# EAGLE design Hydro_Board (EAGLE 9.6.2)
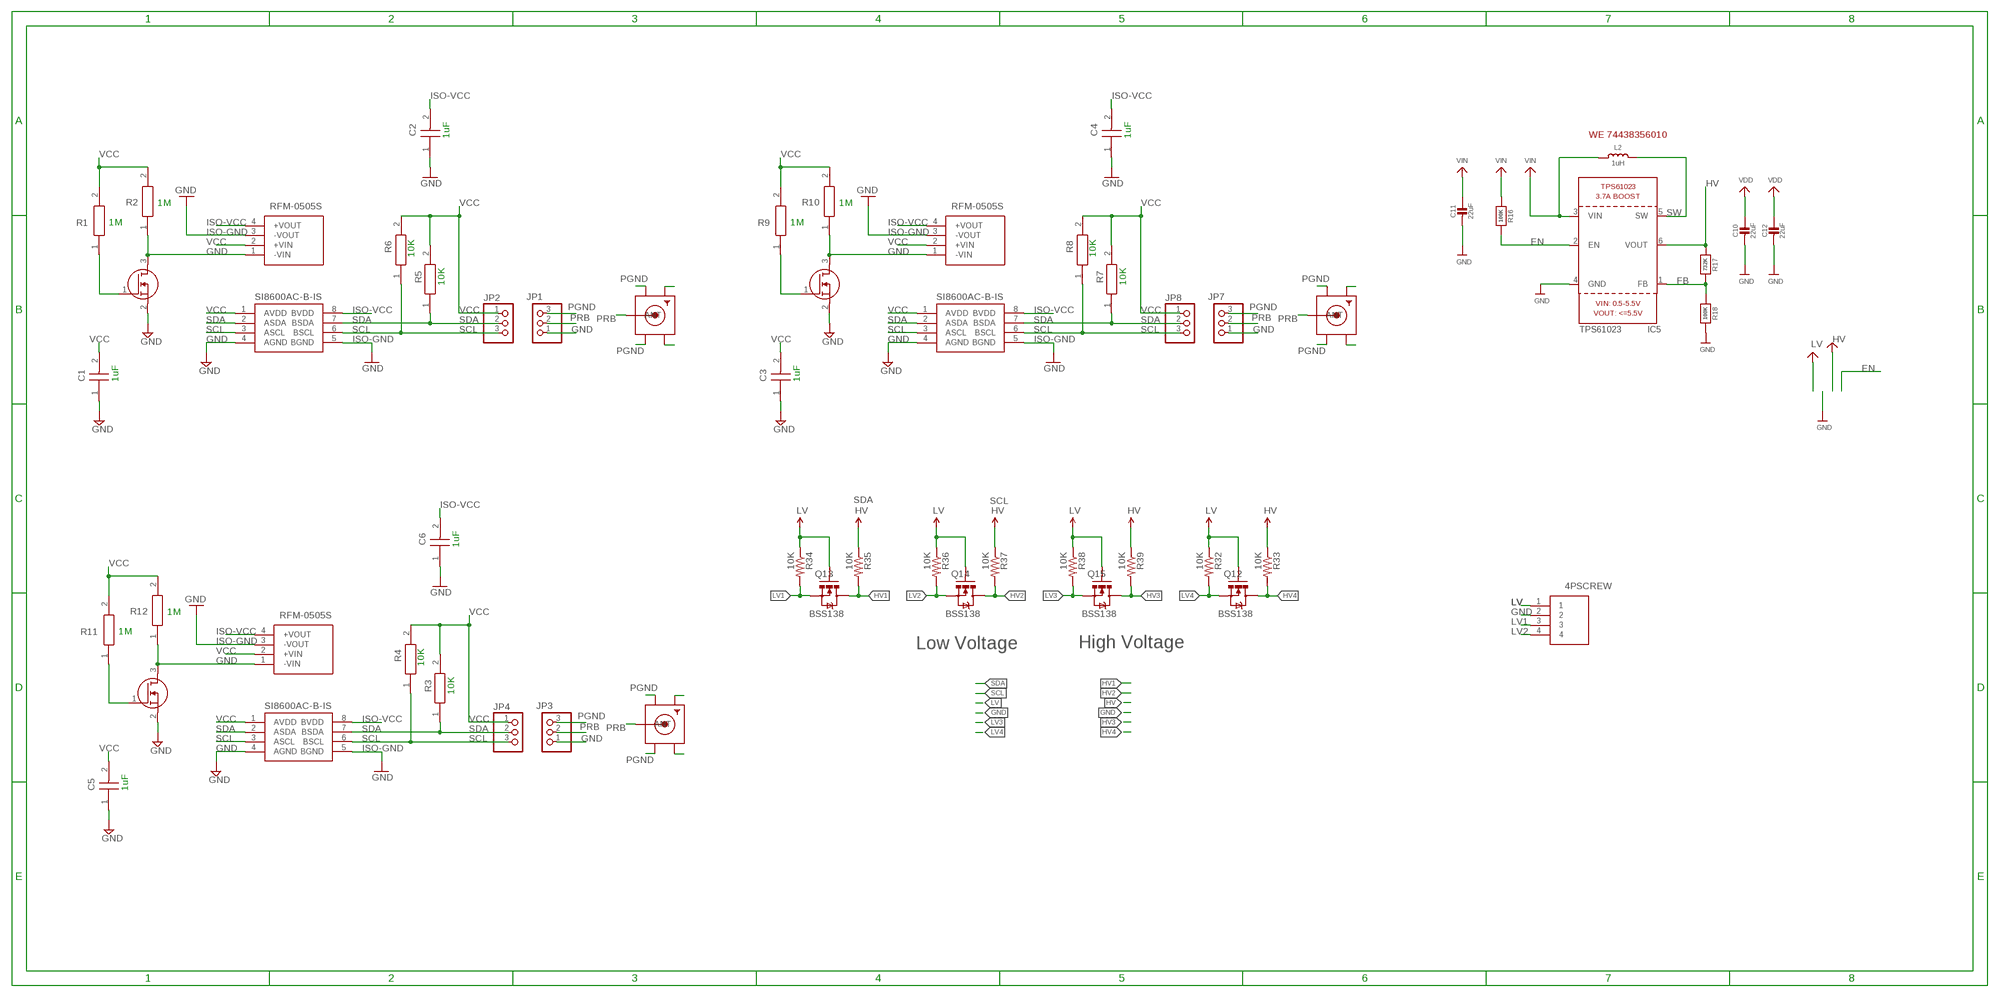
[diagram p0: schematic, sheet 1]

## Parts
4PSCREW  1725672  [1725672]
C1  C1608X5R1E105K080AC  [CAPC1608X80N]
C2  C1608X5R1E105K080AC  [CAPC1608X80N]
C3  C1608X5R1E105K080AC  [CAPC1608X80N]
C4  C1608X5R1E105K080AC  [CAPC1608X80N]
C5  C1608X5R1E105K080AC  [CAPC1608X80N]
C6  C1608X5R1E105K080AC  [CAPC1608X80N]
C10  22uF  CAP_CERAMIC0805-NOOUTLINE  [0805-NO]
C11  22uF  CAP_CERAMIC0805-NOOUTLINE  [0805-NO]
C12  22uF  CAP_CERAMIC0805-NOOUTLINE  [0805-NO]
IC1  SI8600AC-B-IS  [SOIC127P600X175-8N]
IC2  SI8600AC-B-IS  [SOIC127P600X175-8N]
IC4  SI8600AC-B-IS  [SOIC127P600X175-8N]
IC5  TPS61023  [SOT563]
JP1  PINHD-1X3  [1X03]
JP2  PINHD-1X3  [1X03]
JP3  PINHD-1X3  [1X03]
JP4  PINHD-1X3  [1X03]
JP7  PINHD-1X3  [1X03]
JP8  PINHD-1X3  [1X03]
L2  1uH  INDUCTORTDK_VLC5045  [INDUCTOR_5X5MM_TDK_VLC5045]
PS1  RFM-0505S  [RFM0505S]
PS3  RFM-0505S  [RFM0505S]
PS4  RFM-0505S  [RFM0505S]
Q1  BSS119NH6327XTSA1  [SOT95P260X110-3N]
Q2  BSS119NH6327XTSA1  [SOT95P260X110-3N]
Q3  BSS119NH6327XTSA1  [SOT95P260X110-3N]
Q12  BSS138  MOSFET-NCHANNELSMD  [SOT23-3]
Q13  BSS138  MOSFET-NCHANNELSMD  [SOT23-3]
Q14  BSS138  MOSFET-NCHANNELSMD  [SOT23-3]
Q15  BSS138  MOSFET-NCHANNELSMD  [SOT23-3]
R1  ERJ-3EKF1004V  [RESC1608X55N]
R2  ERJ-3EKF1004V  [RESC1608X55N]
R3  CRCW060310K0FKEAHP  [RESC1608X50N]
R4  CRCW060310K0FKEAHP  [RESC1608X50N]
R5  CRCW060310K0FKEAHP  [RESC1608X50N]
R6  CRCW060310K0FKEAHP  [RESC1608X50N]
R7  CRCW060310K0FKEAHP  [RESC1608X50N]
R8  CRCW060310K0FKEAHP  [RESC1608X50N]
R9  ERJ-3EKF1004V  [RESC1608X55N]
R10  ERJ-3EKF1004V  [RESC1608X55N]
R11  ERJ-3EKF1004V  [RESC1608X55N]
R12  ERJ-3EKF1004V  [RESC1608X55N]
R16  100K  RESISTOR_0603_NOOUT  [0603-NO]
R17  732K  RESISTOR_0603_NOOUT  [0603-NO]
R18  100K  RESISTOR_0603_NOOUT  [0603-NO]
R32  10K  RESISTOR0603-RES  [0603-RES]
R33  10K  RESISTOR0603-RES  [0603-RES]
R34  10K  RESISTOR0603-RES  [0603-RES]
R35  10K  RESISTOR0603-RES  [0603-RES]
R36  10K  RESISTOR0603-RES  [0603-RES]
R37  10K  RESISTOR0603-RES  [0603-RES]
R38  10K  RESISTOR0603-RES  [0603-RES]
R39  10K  RESISTOR0603-RES  [0603-RES]
X1  SMACONNECTOR_EDGE  [SMA_EDGELAUNCH]
X2  SMACONNECTOR_EDGE  [SMA_EDGELAUNCH]
X4  SMACONNECTOR_EDGE  [SMA_EDGELAUNCH]

## Nets
EN: IC5.2(EN) R16.2
FB: IC5.1(FB) R17.2 R18.1
GND: 4PSCREW.2 C1.1 C2.1 C3.1 C5.1 C10.2 C11.2 C12.2 IC1.4(AGND) IC2.4(AGND) IC4.4(AGND) IC5.4(GND) JP1.1 JP3.1 JP7.1 PS1.1(-VIN) PS3.1(-VIN) PS4.1(-VIN) Q1.2(S) Q1.3(D) Q2.2(S) Q2.3(D) Q3.2(S) Q3.3(D) R2.1 R10.1 R12.1 R18.2
HV: IC5.6(VOUT) R17.1 R33.1 R39.1 ; supply symbol labelled VDD
HV1: Q13.3(D) R35.2
HV2: Q14.3(D) R37.2
HV3: Q15.3(D) R39.2
HV4: Q12.3(D) R33.2
ISO-GND: IC1.5(BGND) IC2.5(BGND) IC4.5(BGND) PS1.3(-VOUT) PS3.3(-VOUT) PS4.3(-VOUT) ; supply symbol labelled GND
ISO-VCC: C2.2 C4.2 C6.2 IC1.8(BVDD) IC2.8(BVDD) IC4.8(BVDD) PS1.4(+VOUT) PS3.4(+VOUT) PS4.4(+VOUT)
LV: 4PSCREW.1 IC5.3(VIN) L2.P$1 Q12.1(G) Q13.1(G) Q14.1(G) Q15.1(G) R32.1 R34.1 R36.1 R38.1 ; supply symbol labelled VIN
LV1: 4PSCREW.3 Q13.2(S) R34.2
LV2: 4PSCREW.4 Q14.2(S) R36.2
LV3: Q15.2(S) R38.2
LV4: Q12.2(S) R32.2
N$1: C4.1 ; supply symbol labelled GND
N$2: Q1.1(G) R1.1
N$3: X4.GND@3(GND2)
N$4: X2.GND@3(GND2)
N$5: X2.GND@1(GND4)
N$6: C6.1 ; supply symbol labelled GND
N$7: X4.GND@1(GND4)
N$8: Q3.1(G) R11.1
N$11: X1.GND@3(GND2)
N$12: X1.GND@1(GND4)
N$14: Q2.1(G) R9.1
PGND: JP1.3 JP3.3 JP7.3 X1.GND@2(GND3) X1.GND@4(GND1) X2.GND@2(GND3) X2.GND@4(GND1) X4.GND@2(GND3) X4.GND@4(GND1)
PRB: JP1.2 JP3.2 JP7.2 X1.P(ANT) X2.P(ANT) X4.P(ANT)
SCL: IC1.3(ASCL) IC1.6(BSCL) IC2.3(ASCL) IC2.6(BSCL) IC4.3(ASCL) IC4.6(BSCL) JP2.3 JP4.3 JP8.3 R4.1 R6.1 R8.1 R37.1 ; supply symbol labelled HV
SDA: IC1.2(ASDA) IC1.7(BSDA) IC2.2(ASDA) IC2.7(BSDA) IC4.2(ASDA) IC4.7(BSDA) JP2.2 JP4.2 JP8.2 R3.1 R5.1 R7.1 R35.1 ; supply symbol labelled HV
SW: IC5.5(SW) L2.P$2
VCC [New Class]: C1.2 C3.2 C5.2 IC1.1(AVDD) IC2.1(AVDD) IC4.1(AVDD) JP2.1 JP4.1 JP8.1 PS1.2(+VIN) PS3.2(+VIN) PS4.2(+VIN) R1.2 R2.2 R3.2 R4.2 R5.2 R6.2 R7.2 R8.2 R9.2 R10.2 R11.2 R12.2
VDD: C10.1 C12.1
VIN: C11.1 R16.1

## Notes on the sheet
- 1uF | 1uF | WE 74438356010
- 1M | 1M
- 1M | 1M
- 10K | 10K
- 10K | 10K
- 1uF | 1uF
- 1uF
- 1M
- 1M
- Low Voltage | High Voltage
- 10K
- 10K
- 1uF

## Library data of the parts
4PSCREW = 4pin_screw:1725672: 4 way vertical PCB terminal,6A 63V Phoenix Contact Non-Fused Terminal Block, 4 Way, Solder Terminals, 26 ??? 20 AWG Through Hole, Nylon, 63 V Source: Datasheet <https://datasheet.datasheetarchive.com/originals/distributors/SFDatasheet-2/sf-00050602.pdf>; DESCRIPTION: 4 way vertical PCB terminal,6A 63V Phoenix Contact Non-Fused Terminal Block, 4 Way, Solder Terminals, 26 ??? 20 AWG Through Hole, Nylon, 63 V; HEIGHT: 8.65mm; MANUFACTURER_NAME: Phoenix Contact; MANUFACTURER_PART_NUMBER: 1725672; MOUSER_PART_NUMBER: 651-1725672; MOUSER_PRICE-STOCK: https://www.mouser.co.uk/ProductDetail/Phoenix-Contact/1725672?qs=Ul7CXFMnlWXX93F9bOV2pQ%3D%3D
C1-C6 = C1608X5R1E105K080AC (1uF):C1608X5R1E105K080AC: MULTILAYER CERAMIC CHIP CAPACITORS, 1608, Commercial grade, general (Up to 75V) Source: Datasheet <https://product.tdk.com/info/en/catalog/datasheets/mlcc_commercial_midvoltage_en.pdf>; DESCRIPTION: MULTILAYER CERAMIC CHIP CAPACITORS, 1608, Commercial grade, general (Up to 75V); HEIGHT: 0.8mm; MANUFACTURER_NAME: TDK; MANUFACTURER_PART_NUMBER: C1608X5R1E105K080AC; MOUSER_PART_NUMBER: 810-C1608X5R1E105K; MOUSER_PRICE-STOCK: https://www.mouser.co.uk/ProductDetail/TDK/C1608X5R1E105K080AC?qs=NRhsANhppD9KvcnEkFA5Bw%3D%3D
C10-C12 = microbuilder:CAP_CERAMIC: Ceramic Capacitors For new designs, use the packages preceded by an '_' character since they are more reliable: The following footprints should be used on most boards: _0402 - Standard footprint for regular board layouts _0603 - Standard footprint for regular board layouts _0805 - Standard footprint for regular board layouts _1206 - Standard footprint for regular board layouts For extremely tight-pitch boards where space is at a premium, the following 'micro-pitch' footprints can be used (smaller pads, no silkscreen outline, etc.): _0402MP - Micro-pitch footprint for very dense/compact boards _0603MP - Micro-pitch footprint for very dense/compact boards _0805MP - Micro-pitch footprint for very dense/compact boards _1206MP - Micro-pitch footprint for very dense/compact boards
IC1 IC2 IC4 = Digital Isolator:SI8600AC-B-IS: Isolator,digital,I2C,1.7MHz,3.7kV,SOIC8N Silicon Labs Si8600AC-B-IS PCB SMT 2-channel I2C Digital Isolator, 3.75 kVrms, 8-Pin SOIC Source: Datasheet <https://datasheet.datasheetarchive.com/originals/distributors/Datasheets_SAMA/8fa95c8fb9148355fcc305de833d4897.pdf>; ARROW_PART_NUMBER: SI8600AC-B-IS; ARROW_PRICE-STOCK: https://www.arrow.com/en/products/si8600ac-b-is/silicon-labs; DESCRIPTION: Isolator,digital,I2C,1.7MHz,3.7kV,SOIC8N Silicon Labs Si8600AC-B-IS PCB SMT 2-channel I2C Digital Isolator, 3.75 kVrms, 8-Pin SOIC; HEIGHT: 1.75mm; MANUFACTURER_NAME: Silicon Labs; MANUFACTURER_PART_NUMBER: Si8600AC-B-IS; MOUSER_PART_NUMBER: 634-SI8600AC-B-IS; MOUSER_PRICE-STOCK: https://www.mouser.co.uk/ProductDetail/Silicon-Labs/SI8600AC-B-IS/?qs=j6MGy4L9yX3Cr1m5JEs1OA%3D%3D
IC5 = adafruit_power:TPS61023
JP1-JP4 JP7 JP8 = adafruit:PINHD-1X3: PIN HEADER
L2 = microbuilder:INDUCTOR: Inductors 0603: 10nH Ceramic Inductor - microwire antenna/RF (Digikey: 712-1434-2-ND) 0805: 560nH Ceramic Inductor - RF (Digikey: 553-1047-1-ND) 270nH Ceramic Inductor - Q = 40@250MHz, +-5%, 1 Ohm DC Resistance (Digikey: 535-10506-2-ND) 1007 (2518 Metric) SMT: 10µH 10% 250mOhm 820mA 1007 Inductor (Digikey: 587-2189-1-ND) 22µH 10% 500mOhm 580mA 1007 Inductor (Digikey: 587-2190-1-ND) 47µH 10% 950mOhm 420mA 1007 Inductor (Digikey: 587-2191-1-ND) 47µH 5% 100mOhm 1A 1008 Inductor (Digikey: 732-1816-1-ND) 5.0x5.0mm (Taiyo Yuden NR5040 Series) 6.8µH 20% 2.3A 64mOhm Inductor (Digikey: 587-2374-2-ND) 5.0x5.0mm (TDK VLC5045 Series) 4.7µH 20% 3.3A 34mOhm Inductor (Digikey: 445-6526-1-ND) 6.8µH 20% 2.7A 46mOhm Inductor (Digikey: 445-6527-1-ND) 6.0x6.0mm (TDK VLC6045 Series) 4.7µH 20% 3.8A 27mOhm Inductor (Digikey: 445-6538-2-ND) 6.8µH 20% 3A 41mOhm Inductor (Digikey: 445-6540-1-ND) 6.2µH 30% 2.2A 45mOhm Inductor (Digikey: SRR5028-6R2YCT-ND) - Not TDK VLC6045 but footprint should match 6.0x6.0mm (TDK SLF6045 Series) 6.8uH 30% 2A 33mOhm Inductor (Digikey: 445-4572-1-ND, Mouser: 810-SLF645T6R8N2R0PF) 6.0x6.0mm (Sumida CDRH5D28 Series) 6.2uH 30% 1.8A 45mOhm Inductor (Digikey: 308-1542-1-ND) Taiyo Yuden NR3015T2R2M - 2.2uH 20% 1.5A (Digikey: 587-1648-2-ND, Mouser: 963-NR3015T2R2M) - Used with TI TPS62172 CoilCraft RFID Transponder Coil - MA5532-AE (For use with AS3935 Lightning Sensor) Taiyo Yuden NRH2412T2R2MNGH - 2.2uH 20% 1AA (Digikey: 587-3443-1-ND) - Used with TI LM3671 Vishay IHLP 1.0uH Molded Inductor - 24mOhm DCR, 5A, +/-20%, -55°C-125°C (Digikey: 541-1319-1-ND)
PS1 PS3 PS4 = RFM-0505S:RFM-0505S: RECOM POWER - RFM-0505S - DC-DC CONVERTER, 5V, 0.2A Source: Datasheet <https://www.recom-power.com/pdf/Econoline/RFM.pdf>; DESCRIPTION: RECOM POWER - RFM-0505S - DC-DC CONVERTER, 5V, 0.2A; HEIGHT: 10.5mm; MANUFACTURER_NAME: RECOM Power; MANUFACTURER_PART_NUMBER: RFM-0505S; MOUSER_PART_NUMBER: 919-RFM-0505S; MOUSER_PRICE-STOCK: https://www.mouser.co.uk/ProductDetail/RECOM-Power/RFM-0505S?qs=lYGu3FyN48dRVYKTH5ipqg%3D%3D
Q1-Q3 = BSS119NH6327XTSA1 (NMOS):BSS119NH6327XTSA1: Infineon BSS119NH6327XTSA1 N-channel MOSFET Transistor, 0.19 A, 100 V, 3-Pin SOT-23 Source: Datasheet <https://www.infineon.com/dgdl/Infineon-BSS119N-DS-v02_01-en.pdf?fileId=db3a304335f1f4b6013639b6532a164a>; DESCRIPTION: Infineon BSS119NH6327XTSA1 N-channel MOSFET Transistor, 0.19 A, 100 V, 3-Pin SOT-23; HEIGHT: 1.1mm; MANUFACTURER_NAME: Infineon; MANUFACTURER_PART_NUMBER: BSS119NH6327XTSA1; MOUSER_PART_NUMBER: 726-BSS119NH6327XTSA; MOUSER_PRICE-STOCK: https://www.mouser.co.uk/ProductDetail/Infineon-Technologies/BSS119NH6327XTSA1?qs=LxJ0xX%2FWJR7UdSkkikNkig%3D%3D
Q12-Q15 = SparkFun:MOSFET-NCHANNEL
R1 R2 R9-R12 = ERJ-3EKF1004V (1M):ERJ-3EKF1004V: Precision Thick Film Chip Resistor, 0603, 0.1W Source: Datasheet <http://industrial.panasonic.com/cdbs/www-data/pdf/RDA0000/AOA0000C86.pdf>; DESCRIPTION: Precision Thick Film Chip Resistor, 0603, 0.1W; HEIGHT: 0.55mm; MANUFACTURER_NAME: Panasonic; MANUFACTURER_PART_NUMBER: ERJ-3EKF1004V; MOUSER_PART_NUMBER: 667-ERJ-3EKF1004V; MOUSER_PRICE-STOCK: https://www.mouser.co.uk/ProductDetail/Panasonic/ERJ-3EKF1004V?qs=6%252BUraArZVSCwybhfQn7iYg%3D%3D
R3-R8 = CRCW060310K0FKEAHP:CRCW060310K0FKEAHP: CRCW Power Resistor 0603 0.25W 10K 1% Vishay CRCW Series Thick Film Power Resistor 0603 Case 10k?? ??1% 0.25W ??100ppm/K Source: Datasheet <http://www.vishay.com/docs/20043/crcwhpe3.pdf>; DESCRIPTION: CRCW Power Resistor 0603 0.25W 10K 1% Vishay CRCW Series Thick Film Power Resistor 0603 Case 10k?? ??1% 0.25W ??100ppm/K; HEIGHT: 0.5mm; MANUFACTURER_NAME: Vishay; MANUFACTURER_PART_NUMBER: CRCW060310K0FKEAHP; MOUSER_PART_NUMBER: 71-CRCW060310K0FKEAH; MOUSER_PRICE-STOCK: https://www.mouser.co.uk/ProductDetail/Vishay-Dale/CRCW060310K0FKEAHP?qs=FlFvgi4rxBwhwmNEaK0SzQ%3D%3D
R16-R18 = microbuilder:RESISTOR: Resistors For new designs, use the packages preceded by an '_' character since they are more reliable: The following footprints should be used on most boards: _0402 - Standard footprint for regular board layouts _0603 - Standard footprint for regular board layouts _0805 - Standard footprint for regular board layouts _1206 - Standard footprint for regular board layouts For extremely tight-pitch boards where space is at a premium, the following 'micro-pitch' footprints can be used (smaller pads, no silkscreen outline, etc.): _0402MP - Micro-pitch footprint for very dense/compact boards _0603MP - Micro-pitch footprint for very dense/compact boards _0805MP - Micro-pitch footprint for very dense/compact boards _1206MP - Micro-pitch footprint for very dense/compact boards
R32-R39 = SparkFun:RESISTOR: Resistor Basic schematic elements and footprints for 0603, 1206, and PTH resistors.
X1 X2 X4 = adafruit:SMACONNECTOR: SMA Connector 90° DIP SMA Connector, 50 Ohm (4UConnector: 07259)

## Board
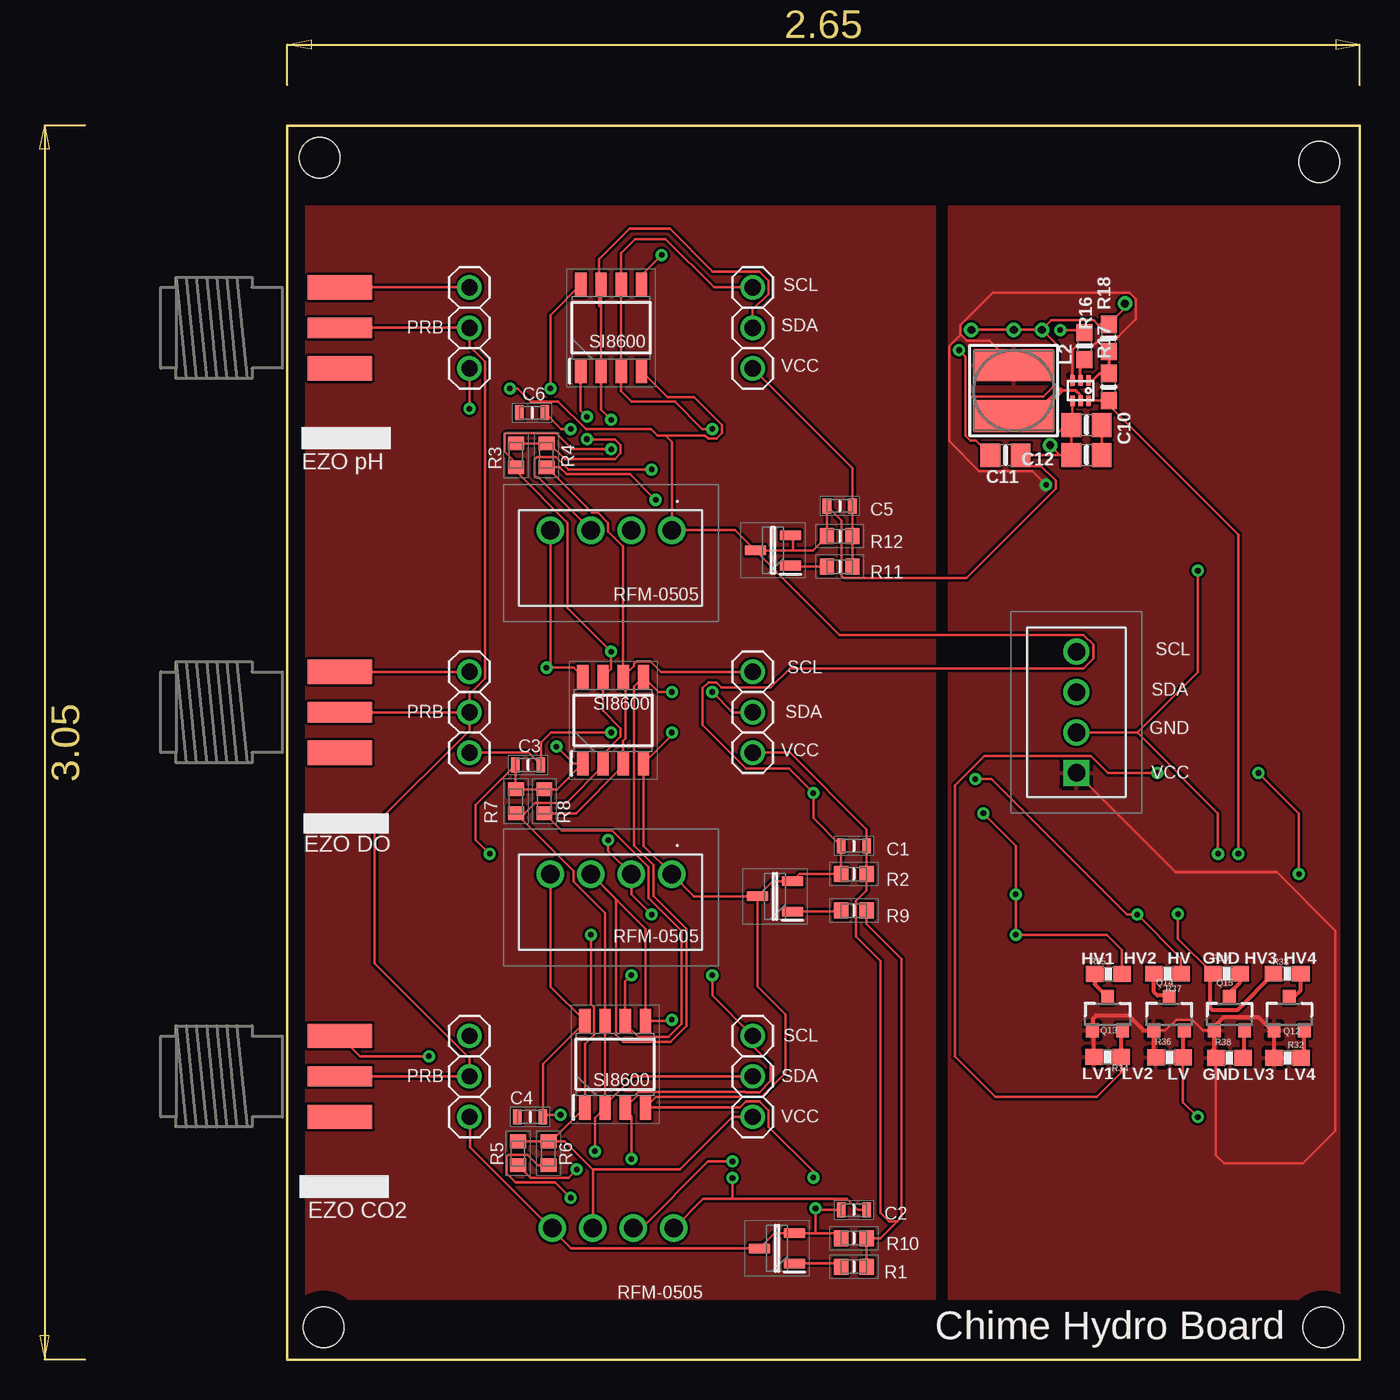
[diagram p1: board, top side]
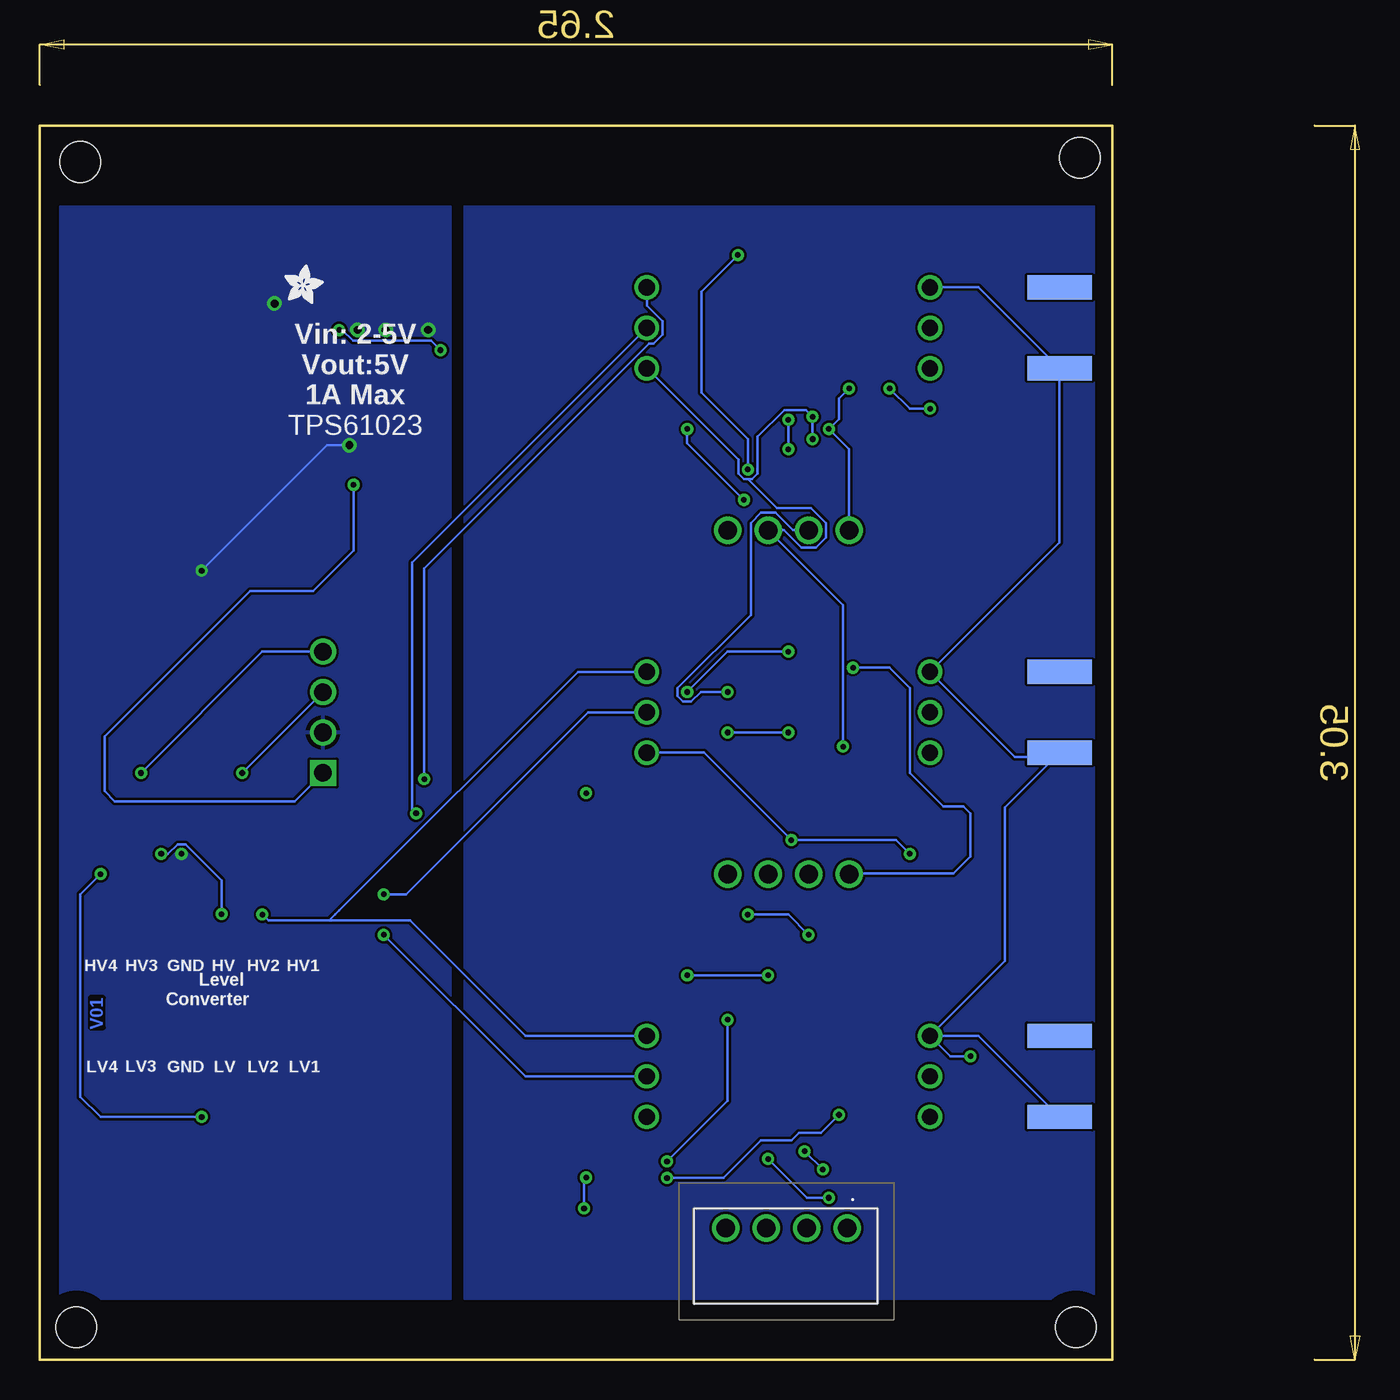
[diagram p2: board, bottom side, seen from below]

Size 67.31 x 77.47 mm. Coordinates in mm from the lower left corner, seen from the top.
Outline: 0,77.47 67.31,77.47 67.31,0 0,0 0,77.47
Copper layers (1*16): Top 0.035mm / dielectric 1.5mm / Bottom 0.035mm
Design rules "default": minimum track width 6mil, minimum drill 0.35mm, track to track 6mil, track to pad 6mil, pad to pad 6mil, via to via 6mil, smd to smd 6mil, copper to edge 40mil, drill to drill 6mil, minimum pad ring 10mil, minimum via ring 8mil, stop-mask expansion 4mil, vias tented up to drill 0mil, thermal gap 10mil
Holes 2.54 mm at 65.02,2.03 2.29,2.03 2.03,75.44 64.77,75.18

### Footprints (pad centres in the part's own frame; a part is rotated, then mirrored left to right if it is on the bottom)
1725672 = drill 1.1 pad 1.65 square: 1 0,0 | drill 1.1 pad 1.65: 2 2.54,0; 3 5.08,0; 4 7.62,0
CAPC1608X80N = smd 0.54 x 0.94: 1 -0.8,0; 2 0.8,0
0805-NO = smd 1.24 x 1.5: 1 -0.95,0; 2 0.95,0
SOIC127P600X175-8N = smd 1.525 x 0.7: 1 -2.712,1.905; 2 -2.712,0.635; 3 -2.712,-0.635; 4 -2.712,-1.905; 5 2.712,-1.905; 6 2.712,-0.635; 7 2.712,0.635; 8 2.712,1.905
SOT563 = smd 0.65 x 0.275: 1 -0.635,0.5; 2 -0.635,0; 3 -0.635,-0.5; 4 0.635,-0.5; 5 0.635,0; 6 0.635,0.5
1X03 = drill 1.016: 1 -2.54,0; 2 0,0; 3 2.54,0
INDUCTOR_5X5MM_TDK_VLC5045 = smd 2 x 5: P$1 -1.6,0; P$2 1.6,0
RFM0505S = drill 1.15 pad 1.725: 1 0,0; 2 2.54,0; 3 5.08,0; 4 7.62,0
SOT95P260X110-3N = smd 1.3 x 0.6: 1 -1.1,0.95; 2 -1.1,-0.95; 3 1.1,0
SOT23-3 = smd 0.8 x 0.9: 1 -0.95,-1; 2 0.95,-1; 3 0,1.1
RESC1608X55N = smd 0.9 x 1: 1 -0.8,0; 2 0.8,0
RESC1608X50N = smd 0.85 x 1: 1 -0.75,0; 2 0.75,0
0603-NO = smd 1.075 x 1: 1 -0.85,0; 2 0.85,0
0603-RES = smd 1.1 x 1: 1 -0.85,0; 2 0.85,0
SMA_EDGELAUNCH = smd 4.064 x 1.524: GND@1 2.032,-2.54; GND@2 2.032,2.54 | smd 4.064 x 1.524 bottom: GND@3 2.032,2.54; GND@4 2.032,-2.54 | smd 4.064 x 1.27: P 2.032,0

### Placement (x,y rotation side)
4PSCREW  49.53,36.83 90 top
C1  35.56,32.26 0 top
C2  35.56,9.4 0 top
C3  15.11,37.34 180 top
C4  15.24,15.24 0 top
C5  34.67,53.59 0 top
C6  15.37,59.44 0 top
C10  50.16,58.67 180 top
C11  45.09,56.77 0 top
C12  50.16,56.79 180 top
IC1  20.57,18.54 90 top
IC2  20.32,64.77 90 top
IC4  20.45,40.13 90 top
IC5  49.78,60.83 270 top
JP1  11.43,17.78 90 top
JP2  29.21,17.78 90 top
JP3  11.43,64.77 90 top
JP4  29.21,64.77 90 top
JP7  11.43,40.64 90 top
JP8  29.21,40.64 90 top
L2  45.59,60.83 270 top
PS1  24.13,52.07 180 top
PS3  16.64,8.26 180 bottom
PS4  24.13,30.48 180 top
Q1  30.73,6.98 180 top
Q2  30.61,29.08 180 top
Q3  30.48,50.8 180 top
Q12  62.89,21.67 0 top
Q13  51.49,21.67 0 top
Q14  55.35,21.67 0 top
Q15  59.13,21.67 0 top
R1  35.56,5.84 0 top
R2  35.56,30.48 0 top
R3  14.35,56.77 90 top
R4  16.26,56.77 90 top
R5  14.48,12.95 90 top
R6  16.38,12.95 90 top
R7  14.35,35.05 90 top
R8  16.13,35.05 90 top
R9  35.56,28.19 0 top
R10  35.56,7.62 0 top
R11  34.67,49.78 0 top
R12  34.67,51.69 0 top
R16  50.04,63.63 270 top
R17  51.56,61.06 90 top
R18  51.56,64.14 90 top
R32  62.79,18.95 0 top
R33  62.76,24.23 0 top
R34  51.49,19 0 top
R35  51.54,24.21 180 top
R36  55.37,18.97 0 top
R37  55.24,24.23 180 top
R38  59.13,18.95 0 top
R39  58.95,24.23 0 top
U$33  [ADAFRUIT_2.5MM]  51.94,66.29 0 bottom
X1  1.27,40.64 0 top
X2  1.27,64.77 0 top
X4  1.27,17.78 0 top

### Tracks (layer width: path | path; a pad name or v marks a point on that pad's centre or on a via)
EN
  Top 0.203: IC5.2 49.78,62.52 R16.2
FB
  Top 0.203: IC5.1 50.54,61.47 50.98,61.91 R17.2 R18.1
GND  (via drill 0.35, 0.5)
  Top 0.152: JP1.1 11.46,15.21 11.46,13.33 16.54,8.26 | PS3.1 16.54,8.26 | 33.15,7.94 Q1.2 30.58,7.94 Q1.3 17.81,6.98 16.54,8.26 | 33.15,7.94 34.45,7.94 R10.1 | v33.02,11.43 33.02,11.81 30.2,14.63 30.2,15.65 29.62,16.23 28.8,16.23 28.4,15.83 IC1.4 23.13,16.48 29.75,16.48 31.27,18 31.27,21.66 29.51,23.42 Q2.3 | 33.15,7.94 v33.15,9.49 33.24,9.4 C2.1 | Q2.3 25.53,29.08 PS4.1 22.35,32.26 IC4.4 24.13,39.2 v24.13,39.37 | JP7.1 15.15,38.1 C3.1 15.91,38.74 16.55,39.37 v20.32,39.37 | 31.75,50.8 32.98,50.8 R12.1 C5.1 34.79,52.67 34.79,49.19 34.93,49.05 42.62,49.05 48.23,54.67 48.23,55.17 47.31,56.1 46.71,56.1 C11.2 46.06,56.79 C12.2 | 31.75,50.8 Q3.3 | Q3.3 28.11,52.07 PS1.1 24.13,57.61 23.73,58.02 | JP3.1 v11.43,59.69 | IC2.4 23.85,60.43 25.52,60.43 27.28,58.67 27.28,58.17 26.92,57.81 26.42,57.81 26.21,58.02 23.73,58.02 | 23.73,58.02 23.22,58.02 22.84,58.4 18.73,58.4 17,60.14 15.27,60.14 14.44,60.96 v13.97,60.96 | Q2.3 30.46,30.03 Q2.2 32.15,30.48 R2.1 C1.1 33.02,34 v33.02,35.56 31.47,37.11 28.8,37.11 26.06,39.85 26.06,42.16 26.42,42.52 26.92,42.52 27.25,42.19 30.33,42.19 31.54,43.4 49.97,43.4 50.58,44.01 50.58,44.89 49.97,45.5 34.65,45.5 30.7,49.46 30.7,49.48 Q3.3 | Q3.2 31.75,51.58 31.75,50.8 | 4PSCREW.2 53.34,39.37 | 53.34,39.37 58.42,34.29 v58.42,31.75 | v57.15,49.53 57.15,43.18 53.34,39.37 | IC5.4 49.28,58.74 C10.2 49.22,58.42 | 49.22,58.42 C12.2 | v47.88,57.4 48.49,56.79 C12.2 | v42.93,64.64 v45.59,64.64 v47.37,64.64 | v47.37,64.64 47.97,65.24 50.63,65.24 50.89,64.98 R18.2 52.58,66 v52.58,66.29 | v47.37,64.64 48.32,63.69 48.32,61.34 47.45,60.46 43,60.46 42.86,60.33 42.86,58.14 43,58 48.19,58 48.6,58.42 49.22,58.42
  Bottom 0.152: v33.02,11.43 33.15,11.3 v33.15,9.49 | v20.32,39.37 v24.13,39.37 | v11.43,59.69 12.7,59.69 v13.97,60.96 | v47.88,57.4 49.28,57.4 v57.15,49.53
  pour Bottom: 41.53,72.39 66.04,72.39 66.04,3.81 41.53,3.81
HV  (via drill 0.35)
  Top 0.152: v59.69,31.75 59.69,51.79 51.56,59.92 R17.1 51.55,60.2 IC5.6 | v55.91,27.97 55.91,26.43 R39.1
  Top 0.254: R33.1 59.65,21.97 58.04,21.97 57.91,22.1 57.91,24.04 R39.1
  Bottom 0.152: v55.91,27.97 55.91,30.1 58.17,32.36 58.67,32.36 59.28,31.75 v59.69,31.75
HV1
  Top 0.254: R35.2 50.69,23.57 Q13.3
HV2
  Top 0.254: Q14.3 55.25,22.86 54.61,22.86 54.4,23.07 R37.2
HV3
  Top 0.254: R39.2 59.8,23.69 59.13,23.02 Q15.3
HV4
  Top 0.254: Q12.3 63.18,22.77 63.6,23.19 R33.2
ISO-GND  (via drill 0.35)
  Top 0.152: PS3.3 22.23,8.26 26.42,12.45 v27.94,12.45 | v24.13,21.34 24.05,21.25 IC1.5 22.48,27.05 PS4.3 20.63,28.9 20.63,20.4 21.07,19.96 24.04,19.96 25.04,20.96 25.04,27.05 22.99,29.1 22.99,31.06 21.77,32.27 21.77,42.27 IC4.5 23.29,41.91 v24.13,41.91 | PS1.3 15.76,55.37 15.66,55.37 15.53,55.5 15.53,56.54 15.66,56.67 16.85,56.67 17.64,55.88 v22.86,55.88 | v23.5,69.34 22.23,68.07 IC2.5
  Bottom 0.152: v27.94,12.45 24.13,16.26 v24.13,21.34 | v24.13,41.91 25.81,41.91 26.42,41.3 26.92,41.3 27.28,41.66 27.28,42.16 22.68,46.76 22.68,52.52 22.04,53.16 21.14,53.16 20.05,52.07 PS1.3 | v22.86,55.88 22.86,57.79 25.78,60.71 25.78,67.06 v23.5,69.34
ISO-VCC  (via drill 0.35)
  Top 0.152: C2.2 35.82,9.4 35.12,10.1 27.94,10.1 | 27.94,10.1 26.1,10.1 PS3.4 | v17.14,15.37 16.17,15.37 C4.2 16.04,18.58 18.67,21.21 IC1.8 16.51,23.41 PS4.4 | v27.94,11.41 27.94,10.1 | IC4.8 17.95,43.43 v16.26,43.43 16.51,43.69 PS1.4 | IC2.8 16.51,65.58 v16.51,60.96 | v17.78,58.42 17.18,58.42 C6.2
  Bottom 0.152: v27.94,11.41 24.41,11.41 22.05,13.76 20.11,13.76 19.65,14.22 18.29,14.22 v17.14,15.37 | PS4.4 16.48,30.51 9.96,30.51 8.89,31.58 8.89,34.29 9.32,34.72 10.59,34.72 12.7,36.83 12.7,42.16 13.97,43.43 v16.26,43.43 | v16.51,60.96 17.14,60.33 17.14,59.05 v17.78,58.42 16.51,57.15 PS1.4
ISO_GND
  pour Bottom: 0,72.39 40.64,72.39 40.64,3.81 0,3.81
ISO_VCC
  pour Top: 0,72.39 40.64,72.39 40.64,3.81 0,3.81
LV  (via drill 0.35)
  Top 0.152: 4PSCREW.1 55.75,30.61 62.1,30.61 65.79,26.92 65.79,14.35 63.75,12.32 58.8,12.32 58.28,12.84 R38.1 | 42.24,64.36 42.24,64.92 44.3,66.98 52.86,66.98 53.26,66.58 53.26,65.32 52.16,64.22 51.13,64.22 50.77,63.85 50.63,63.71 49.61,63.71 49.28,63.38 IC5.3 | 42.24,64.36 42.64,63.96 44.06,63.96 L2.P$1 | 42.24,64.36 42.24,64.31 41.56,63.62 41.56,57.65 43.42,55.79 46.75,55.79 v47.62,54.92 | Q14.1 55.12,20.67 55.8,21.34 56.79,21.34 57.47,20.67 Q15.1 | Q12.1 61.78,20.67
  Top 0.254: R34.1 50.64,20.57 50.6,20.61 | 50.6,20.61 Q13.1 | R36.1 54.4,19.1 Q14.1 53.76,20.67 52.81,21.61 50.77,21.61 50.6,21.44 50.6,20.61 | R38.1 57.93,19.3 58.18,19.56 Q15.1 58.18,20.92 58.77,21.51 60.94,21.51 61.78,20.67 | R32.1 61.81,19.07 61.94,19.2 Q12.1
  Bottom 0.152: 4PSCREW.1 51.31,35.05 62.61,35.05 63.25,35.69 63.25,39.12 54.1,48.26 50.16,48.26 47.62,50.8 v47.62,54.92
  pour Top: 41.91,72.39 66.04,72.39 66.04,3.81 41.53,3.81 41.53,72.39
LV1  (via drill 0.35)
  Top 0.152: v54.61,36.83 51.5,36.83 50.45,37.88 43.76,37.88 41.91,36.04 41.91,19.05 44.45,16.51 50.8,16.51 52.34,18.05 R34.2
  Top 0.254: R34.2 52.34,20.57 Q13.2
  Bottom 0.152: 4PSCREW.3 v54.61,36.83
LV2  (via drill 0.35)
  Top 0.152: v60.96,36.83 63.5,34.29 v63.5,30.48 | R36.2 56.22,16.17 v57.15,15.24
  Top 0.254: Q14.2 56.22,20.59 R36.2
  Bottom 0.152: 4PSCREW.4 53.34,44.45 v60.96,36.83 | v63.5,30.48 64.77,29.21 64.77,16.51 63.5,15.24 v57.15,15.24
LV3
  Top 0.254: R38.2 59.83,19.1 60.08,19.36 Q15.2
LV4
  Top 0.254: R32.2 63.84,19.15 Q12.2
N$2
  Top 0.152: Q1.1 34.57,6.04 R1.1
N$8
  Top 0.152: Q3.1 31.65,49.78 R11.1
N$14
  Top 0.152: Q2.1 34.7,28.13 R9.1
PGND  (via drill 0.35)
  Top 0.152: X1.GND@2 JP7.3 | X2.GND@2 JP3.3 | X4.GND@2 4.57,19.05 v8.89,19.05
  Bottom 0.152: X4.GND@4 8.38,20.32 JP1.3 | X1.GND@4 3.56,37.85 | 3.56,37.85 6.73,34.67 6.73,25.02 JP1.3 | JP3.3 8.38,67.31 X2.GND@4 3.3,51.31 JP7.3 6.1,37.85 3.56,37.85 | v8.89,19.05 10.16,19.05 JP1.3
PRB
  Top 0.152: X4.P JP1.2 11.43,18.92 5.49,24.86 5.49,33.56 11.43,39.5 JP7.2 | X1.P JP7.2 | X2.P JP3.2 11.43,63.63 12.42,62.64 12.42,42.77 11.43,41.78 JP7.2
SCL  (via drill 0.35)
  Top 0.152: v21.59,12.6 21.61,12.62 21.61,15.26 21.21,15.66 IC1.3 21.9,16.52 21.9,16.69 22.03,16.82 28.77,16.82 28.8,16.79 29.62,16.79 30.33,17.5 30.33,18.57 29.21,19.69 JP2.3 26.67,22.86 v26.67,24.13 | v17.78,10.16 16.82,11.12 14.31,11.12 13.75,11.68 13.75,12.72 13.88,12.86 15.07,12.86 15.74,12.19 16.37,12.19 R6.1 | IC4.6 21.23,42.69 21.23,38.99 21.08,38.84 IC4.3 21.08,37.25 18.13,34.3 R8.1 17.21,33.22 20.39,33.22 22.68,30.93 22.68,28.98 24.74,26.92 24.74,21.09 23.91,20.26 22.03,20.26 21.21,21.09 IC1.6 21.21,23.75 v21.59,24.13 | JP8.3 23.45,43.18 22.8,43.84 21.91,43.84 21.77,43.7 21.77,43.54 IC4.6 | IC4.6 21.08,51.04 20.14,51.98 20.14,52.52 19.5,53.16 19.11,53.16 R4.1 17.07,56.02 17.52,55.58 21.51,55.58 v23.11,53.98 | v26.67,58.42 26.03,58.42 24.32,60.13 21.61,60.13 20.95,60.79 IC2.3 IC2.6 20.95,69.47 21.82,70.33 23.75,70.33 26.77,67.31 JP4.3 | R37.1 56.09,25.18 v53.34,27.94 52.7,27.94 44.2,36.45 v43.18,36.45
  Bottom 0.152: v21.59,12.6 19.15,10.16 v17.78,10.16 | v23.11,53.98 26.67,57.53 v26.67,58.42 | v26.67,24.13 v21.59,24.13 | JP2.3 36.83,20.32 44.07,27.56 49.15,27.56 | v53.34,27.94 52.96,27.56 49.53,27.56 49.15,27.56 | JP8.3 33.53,43.18 48.51,28.19 48.77,27.94 49.15,27.56 | v43.18,36.45 43.18,49.66 29.06,63.78 28.8,63.78 28.22,64.36 28.22,65.18 29.21,66.17 JP4.3
SDA  (via drill 0.35)
  Top 0.152: R5.1 15.25,11.43 17.65,11.43 v18.16,11.94 | v19.3,13.08 19.3,15.2 IC1.2 | IC1.2 19.94,16 21.72,17.78 JP2.2 | IC1.2 IC1.7 19.94,28.05 17.96,30.03 17.96,30.69 R7.1 14.88,34.3 15.53,34.96 17.51,34.96 19.81,37.25 IC4.2 19.81,38 20.93,39.12 20.93,39.62 19.81,40.74 IC4.7 20.32,43.35 v20.32,44.45 17.6,47.17 17.6,52.52 14.35,55.77 R3.1 14.35,56.27 13.62,57 13.62,58.04 13.76,58.17 16.85,58.17 17.87,57.15 v20.32,57.15 | JP8.2 27.94,40.64 v26.67,41.91 | v20.32,59.01 19.68,59.64 IC2.2 19.68,66.04 | IC2.7 19.68,66.04 | JP4.2 29.21,65.91 30.2,66.9 30.2,67.72 29.62,68.3 26.7,68.3 24,70.99 21.46,70.99 19.56,69.09 19.56,66.17 19.68,66.04 | R35.1 52.39,25.73 51.45,26.67 v45.72,26.67 v45.72,29.21 45.72,32.26 v43.69,34.29
  Bottom 0.152: v19.3,13.08 v18.16,11.94 | v26.67,41.91 24.13,44.45 v20.32,44.45 | v20.32,57.15 v20.32,59.01 | JP2.2 36.83,17.78 v45.72,26.67 | JP8.2 32.89,40.64 44.32,29.21 v45.72,29.21 | JP4.2 43.94,50.04 43.94,34.54 v43.69,34.29
SW
  Top 0.178: IC5.5 49.74,60.24 49.74,60.6 49.5,60.83 48.51,60.83
  Top 0.406: 48.51,60.83 47.62,59.94 47.62,59.44 46.23,59.44 46.02,59.23 L2.P$2
VCC  (via drill 0.35)
  Top 0.152: R5.2 R6.2 | 19.18,11.93 17.4,13.7 R6.2 | 19.18,11.93 19.18,11.94 24.64,11.94 27.94,15.24 JP2.1 | 19.18,11.93 PS3.2 | R6.2 16.54,13.7 IC1.1 18.67,19.82 19.25,20.4 19.25,22.11 19.05,22.31 v19.05,26.67 | JP8.1 31.53,38.1 36.36,33.27 C1.2 R2.2 36.36,29.47 35.68,28.79 35.68,26.58 37.24,25.02 37.24,9.21 37.76,8.7 38.3,8.7 | v22.86,27.94 21.59,29.21 PS4.2 20.14,31.93 v20.14,32.62 | v12.7,31.75 11.81,32.64 11.81,34.84 C3.2 14.31,35.84 R7.2 R8.2 16.92,35.8 IC4.1 17.95,37.42 v16.89,38.48 | JP4.1 35.47,55.97 C5.2 R12.2 R11.2 | R3.2 R4.2 16.44,57.52 17.41,56.54 20.57,56.54 20.93,56.9 20.93,57.4 20.57,57.76 18.82,57.76 v18.8,57.79 | v18.8,59.19 18.41,59.58 IC2.1 | R9.2 36.36,27.35 38.56,25.15 38.56,8.96 38.3,8.7 | 38.3,8.7 37.22,7.62 R10.2 R1.2
  Bottom 0.152: v19.05,26.67 20.32,27.94 v22.86,27.94 | v12.7,31.75 13.56,32.62 v20.14,32.62 25.62,38.1 JP8.1 | v16.89,38.48 16.89,47.37 PS1.2 20.59,52.07 19.5,50.98 18.6,50.98 17.96,51.62 17.96,52.52 18.9,53.47 21.05,53.47 22.86,55.27 | v18.8,57.79 18.8,59.18 v18.8,59.19 19.23,59.61 20.57,59.61 22.25,57.93 22.25,55.63 22.61,55.27 22.86,55.27 | 22.86,55.27 23.11,55.27 23.47,55.63 23.47,56.49 JP4.1
VDD
  Top 0.152: C10.1 C12.1
VIN  (via drill 0.35)
  Top 0.152: C11.1 43.2,57.7 42.87,57.7 42.56,58.01 42.56,62.98 v42.16,63.37 | v48.51,64.64 49.88,64.64 R16.1
  Bottom 0.152: v42.16,63.37 42.75,63.96 47.65,63.96 48.33,64.64 v48.51,64.64

### Text on the board
Bottom: V01
tPlace: SCL | PRB | SDA | SI8600 | VCC | C6 | EZO pH | R3 | R4 | C5 | R12 | R11 | RFM-0505 | SCL | SCL | SDA | PRB | SI8600 | SDA | GND | C3 | VCC | VCC | R7 | R8 | EZO DO | C1 | R2 | R9 | RFM-0505 | HV1 | HV2 | HV | GND | HV3 | HV4 | SCL | PRB | SI8600 | SDA | LV1 | LV2 | LV | GND | LV3 | LV4 | C4 | VCC | R5 | R6 | EZO CO2 | C2 | R10 | R1 | RFM-0505 | Chime Hydro Board
bPlace: Vin: 2-5V / Vout:5V / 1A Max | TPS61023 | HV1 | Level / Converter | HV2 | HV | GND | HV3 | HV4 | LV1 | LV2 | LV | GND | LV3 | LV4